# Altium project MezzRev4.PrjPcb (part 3 of 4)

## Sheet DfMUX_ADC.SchDoc: Digital fMUX Mezzanine - ADC
size 513 x 386 mm; Engineer: M.Dobbs, McGill U.; Revision: 4
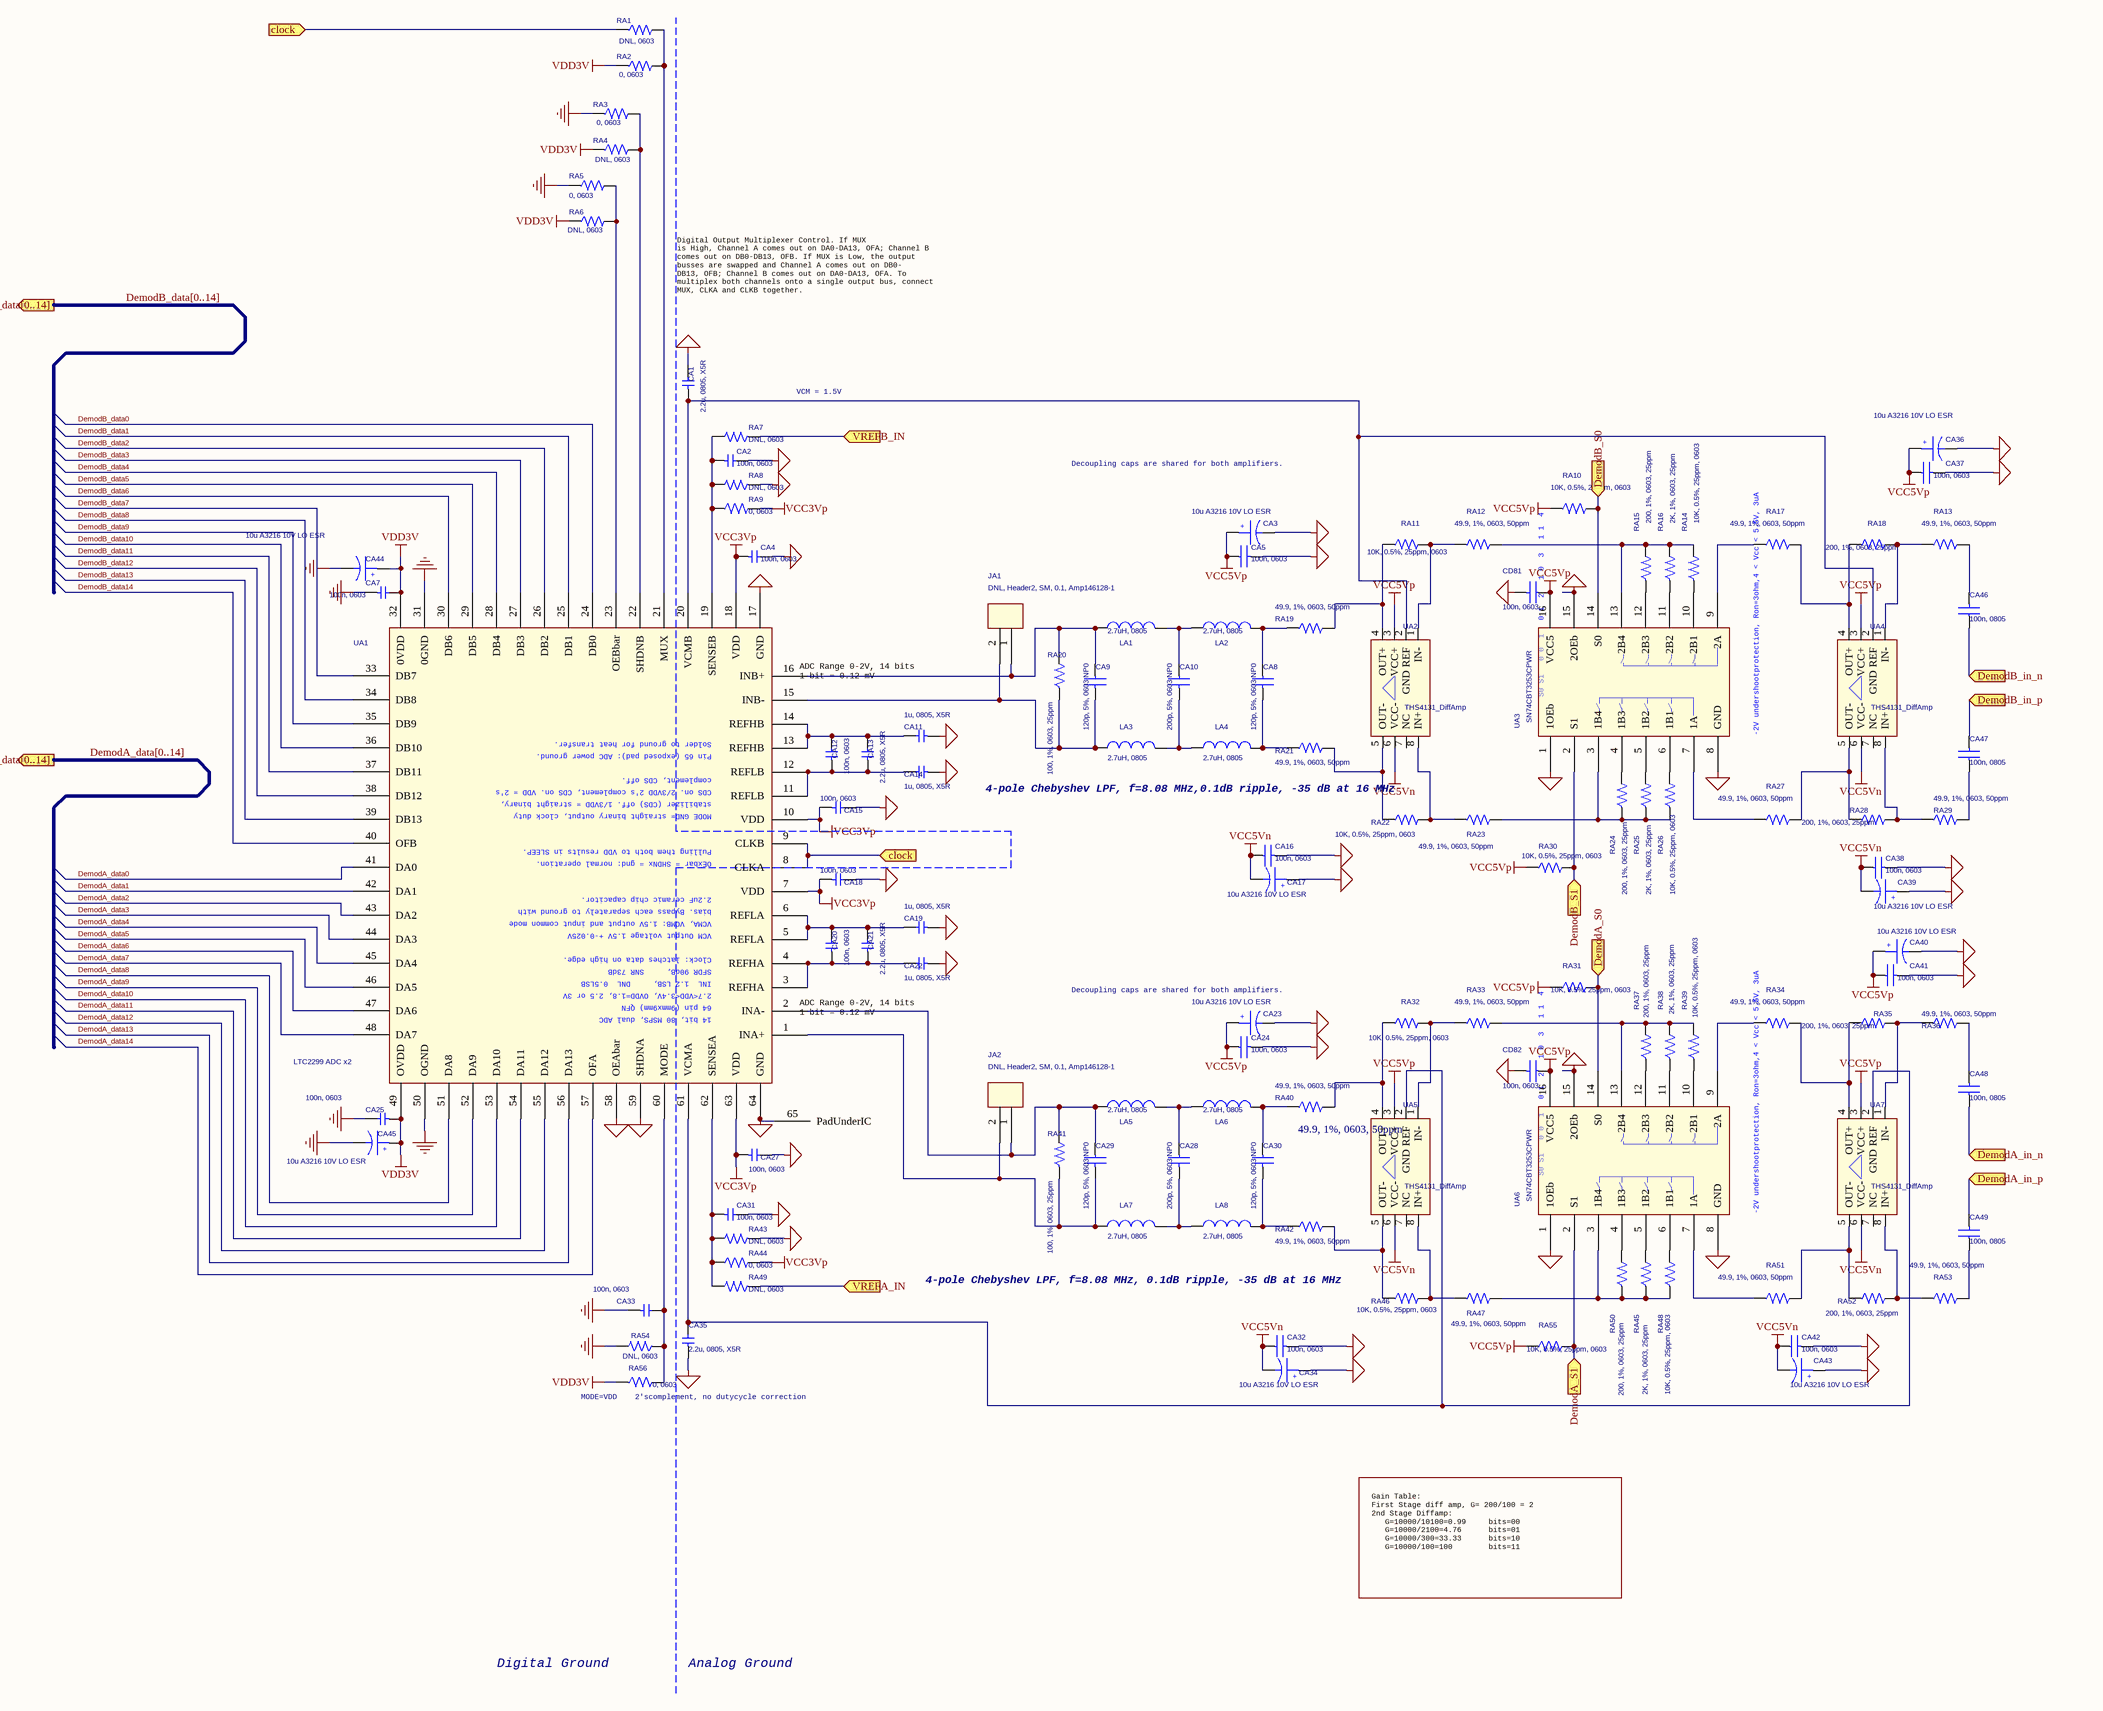
[diagram p6: DfMUX_ADC.SchDoc]

### Parts
CA1  2.2u, 0805, X5R  [0805C]
CA2  100n, 0603  [0603C]
CA3  10u A3216 10V LO ESR  [TANTA]
CA4  100n, 0603  [0603C]
CA5  100n, 0603  [0603C]
CA7  100n, 0603  [0603C]
CA8  120p, 5%, 0603 NP0  [0603C]
CA9  120p, 5%, 0603 NP0  [0603C]
CA10  200p, 5%, 0603 NP0  [0603C]
CA11  1u, 0805, X5R  [0805C]
CA12  100n, 0603  [0603C]
CA13  2.2u, 0805, X5R  [0805C]
CA14  1u, 0805, X5R  [0805C]
CA15  100n, 0603  [0603C]
CA16  100n, 0603  [0603C]
CA17  10u A3216 10V LO ESR  [TANTA]
CA18  100n, 0603  [0603C]
CA19  1u, 0805, X5R  [0805C]
CA20  100n, 0603  [0603C]
CA21  2.2u, 0805, X5R  [0805C]
CA22  1u, 0805, X5R  [0805C]
CA23  10u A3216 10V LO ESR  [TANTA]
CA24  100n, 0603  [0603C]
CA25  100n, 0603  [0603C]
CA27  100n, 0603  [0603C]
CA28  200p, 5%, 0603 NP0  [0603C]
CA29  120p, 5%, 0603 NP0  [0603C]
CA30  120p, 5%, 0603 NP0  [0603C]
CA31  100n, 0603  [0603C]
CA32  100n, 0603  [0603C]
CA33  100n, 0603  [0603C]
CA34  10u A3216 10V LO ESR  [TANTA]
CA35  2.2u, 0805, X5R  [0805C]
CA36  10u A3216 10V LO ESR  [TANTA]
CA37  100n, 0603  [0603C]
CA38  100n, 0603  [0603C]
CA39  10u A3216 10V LO ESR  [TANTA]
CA40  10u A3216 10V LO ESR  [TANTA]
CA41  100n, 0603  [0603C]
CA42  100n, 0603  [0603C]
CA43  10u A3216 10V LO ESR  [TANTA]
CA44  10u A3216 10V LO ESR  [TANTA]
CA45  10u A3216 10V LO ESR  [TANTA]
CA46  100n, 0805  [0805C]
CA47  100n, 0805  [0805C]
CA48  100n, 0805  [0805C]
CA49  100n, 0805  [0805C]
CD81  100n, 0603  [0603C]
CD82  100n, 0603  [0603C]
JA1  DNL, Header2, SM, 0.1, Amp146128-1  [HEADER_AMP146128]
JA2  DNL, Header2, SM, 0.1, Amp146128-1  [HEADER_AMP146128]
LA1  2.7uH, 0805  [0805L]
LA2  2.7uH, 0805  [0805L]
LA3  2.7uH, 0805  [0805L]
LA4  2.7uH, 0805  [0805L]
LA5  2.7uH, 0805  [0805L]
LA6  2.7uH, 0805  [0805L]
LA7  2.7uH, 0805  [0805L]
LA8  2.7uH, 0805  [0805L]
RA1  DNL, 0603  [0603R]
RA2  0, 0603  [0603R]
RA3  0, 0603  [0603R]
RA4  DNL, 0603  [0603R]
RA5  0, 0603  [0603R]
RA6  DNL, 0603  [0603R]
RA7  DNL, 0603  [0603R]
RA8  DNL, 0603  [0603R]
RA9  0, 0603  [0603R]
RA10  10K, 0.5%, 25ppm, 0603  [0603R]
RA11  10K, 0.5%, 25ppm, 0603  [0603R]
RA12  49.9, 1%, 0603, 50ppm  [0603R]
RA13  49.9, 1%, 0603, 50ppm  [0603R]
RA14  10K, 0.5%, 25ppm, 0603  [0603R]
RA15  200, 1%, 0603, 25ppm  [0603R]
RA16  2K, 1%, 0603, 25ppm  [0603R]
RA17  49.9, 1%, 0603, 50ppm  [0603R]
RA18  200, 1%, 0603, 25ppm  [0603R]
RA19  49.9, 1%, 0603, 50ppm  [0603R]
RA20  100, 1%, 0603, 25ppm  [0603R]
RA21  49.9, 1%, 0603, 50ppm  [0603R]
RA22  10K, 0.5%, 25ppm, 0603  [0603R]
RA23  49.9, 1%, 0603, 50ppm  [0603R]
RA24  200, 1%, 0603, 25ppm  [0603R]
RA25  2K, 1%, 0603, 25ppm  [0603R]
RA26  10K, 0.5%, 25ppm, 0603  [0603R]
RA27  49.9, 1%, 0603, 50ppm  [0603R]
RA28  200, 1%, 0603, 25ppm  [0603R]
RA29  49.9, 1%, 0603, 50ppm  [0603R]
RA30  10K, 0.5%, 25ppm, 0603  [0603R]
RA31  10K, 0.5%, 25ppm, 0603  [0603R]
RA32  10K, 0.5%, 25ppm, 0603  [0603R]
RA33  49.9, 1%, 0603, 50ppm  [0603R]
RA34  49.9, 1%, 0603, 50ppm  [0603R]
RA35  200, 1%, 0603, 25ppm  [0603R]
RA36  49.9, 1%, 0603, 50ppm  [0603R]
RA37  200, 1%, 0603, 25ppm  [0603R]
RA38  2K, 1%, 0603, 25ppm  [0603R]
RA39  10K, 0.5%, 25ppm, 0603  [0603R]
RA40  49.9, 1%, 0603, 50ppm  [0603R]
RA41  100, 1%, 0603, 25ppm  [0603R]
RA42  49.9, 1%, 0603, 50ppm  [0603R]
RA43  DNL, 0603  [0603R]
RA44  0, 0603  [0603R]
RA45  2K, 1%, 0603, 25ppm  [0603R]
RA46  10K, 0.5%, 25ppm, 0603  [0603R]
RA47  49.9, 1%, 0603, 50ppm  [0603R]
RA48  10K, 0.5%, 25ppm, 0603  [0603R]
RA49  DNL, 0603  [0603R]
RA50  200, 1%, 0603, 25ppm  [0603R]
RA51  49.9, 1%, 0603, 50ppm  [0603R]
RA52  200, 1%, 0603, 25ppm  [0603R]
RA53  49.9, 1%, 0603, 50ppm  [0603R]
RA54  DNL, 0603  [0603R]
RA55  10K, 0.5%, 25ppm, 0603  [0603R]
RA56  0, 0603  [0603R]
UA1  LTC2299 ADC x2  [QFN64(9X9)]
UA2  THS4131_DiffAmp  [SO8/L200]
UA3  SN74CBT3253CPWR  [TSSOP16]
UA4  THS4131_DiffAmp  [SO8/L200]
UA5  THS4131_DiffAmp  [SO8/L200]
UA6  SN74CBT3253CPWR  [TSSOP16]
UA7  THS4131_DiffAmp  [SO8/L200]

### Ports
clock, DemodA_data[0..14], DemodA_in_n, DemodA_in_p, DemodA_S0, DemodA_S1, DemodB_data[0..14], DemodB_in_n, DemodB_in_p, DemodB_S0, DemodB_S1, VREFA_IN, VREFB_IN

### Nets
GND_DIG: CA7.1 CA25.2 CA33.1 CA44.2 CA45.2 RA3.1 RA5.1 RA54.2 UA1.31(0GND) UA1.50(OGND)
GND_SIGNAL: CA1.2 CA2.2 CA3.2 CA4.2 CA5.2 CA11.1 CA14.1 CA15.2 CA16.2 CA17.1 CA18.2 CA19.1 CA22.1 CA23.2 CA24.2 CA27.2 CA31.2 CA32.2 CA34.1 CA35.1 CA36.2 CA37.2 CA38.2 CA39.1 CA40.2 CA41.2 CA42.2 CA43.1 CD81.2 CD82.2 RA8.1 RA43.1 UA1.17(GND) UA1.58(OEAbar) UA1.59(SHDNA) UA1.64(GND) UA1.65(PadUnderIC) UA3.1(1OEb) UA3.8(GND) UA3.15(2OEb) UA6.1(1OEb) UA6.8(GND) UA6.15(2OEb)
VCC3Vp: CA4.1 CA15.1 CA18.1 CA27.1 RA9.2 RA44.2 UA1.7(VDD) UA1.10(VDD) UA1.18(VDD) UA1.63(VDD)
VCC5Vn: CA16.1 CA17.2 CA32.1 CA34.2 CA38.1 CA39.2 CA42.1 CA43.2 UA2.6(VCC-) UA4.6(VCC-) UA5.6(VCC-) UA7.6(VCC-)
VCC5Vp: CA3.1 CA5.1 CA23.1 CA24.1 CA36.1 CA37.1 CA40.1 CA41.1 CD81.1 CD82.1 RA10.1 RA30.1 RA31.1 RA55.1 UA2.3(VCC+) UA3.16(VCC5) UA4.3(VCC+) UA5.3(VCC+) UA6.16(VCC5) UA7.3(VCC+)
VDD3V: CA7.2 CA25.1 CA44.1 CA45.1 RA2.1 RA4.1 RA6.1 RA56.1 UA1.32(0VDD) UA1.49(OVDD)
DemodA_data0: UA1.41(DA0)  [project net B_DATA0]
DemodA_data1: UA1.42(DA1)  [project net B_DATA1]
DemodA_data2: UA1.43(DA2)  [project net B_DATA2]
DemodA_data3: UA1.44(DA3)  [project net B_DATA3]
DemodA_data4: UA1.45(DA4)  [project net B_DATA4]
DemodA_data5: UA1.46(DA5)  [project net B_DATA5]
DemodA_data6: UA1.47(DA6)  [project net B_DATA6]
DemodA_data7: UA1.48(DA7)  [project net B_DATA7]
DemodA_data8: UA1.51(DA8)  [project net B_DATA8]
DemodA_data9: UA1.52(DA9)  [project net B_DATA9]
DemodA_data10: UA1.53(DA10)  [project net B_DATA10]
DemodA_data11: UA1.54(DA11)  [project net B_DATA11]
DemodA_data12: UA1.55(DA12)  [project net B_DATA12]
DemodA_data13: UA1.56(DA13)  [project net B_DATA13]
DemodA_data14: UA1.57(OFA)  [project net B_DATA14]
DemodB_data0: UA1.24(DB0)  [project net B_DATA0]
DemodB_data1: UA1.25(DB1)  [project net B_DATA1]
DemodB_data2: UA1.26(DB2)  [project net B_DATA2]
DemodB_data3: UA1.27(DB3)  [project net B_DATA3]
DemodB_data4: UA1.28(DB4)  [project net B_DATA4]
DemodB_data5: UA1.29(DB5)  [project net B_DATA5]
DemodB_data6: UA1.30(DB6)  [project net B_DATA6]
DemodB_data7: UA1.33(DB7)  [project net B_DATA7]
DemodB_data8: UA1.34(DB8)  [project net B_DATA8]
DemodB_data9: UA1.35(DB9)  [project net B_DATA9]
DemodB_data10: UA1.36(DB10)  [project net B_DATA10]
DemodB_data11: UA1.37(DB11)  [project net B_DATA11]
DemodB_data12: UA1.38(DB12)  [project net B_DATA12]
DemodB_data13: UA1.39(DB13)  [project net B_DATA13]
DemodB_data14: UA1.40(OFB)  [project net B_DATA14]
Net=Rd37_PartReference_dac_block1_2: RA7.1 ; port VREFB_IN
Net=Rd37_PartReference_dac_block4_2: RA49.1 ; port VREFA_IN
NetCA1_1: CA1.1 UA1.20(VCMB) UA2.2(GND_REF) UA4.2(GND_REF)
NetCA2_1: CA2.1 RA7.2 RA8.2 RA9.1 UA1.19(SENSEB)
NetCA8_1: CA8.1 LA2.2 RA19.1
NetCA8_2: CA8.2 LA4.2 RA21.1
NetCA9_1: CA9.1 JA1.1 LA1.1 RA20.2 UA1.16(INB+)
NetCA9_2: CA9.2 JA1.2 LA3.1 RA20.1 UA1.15(INB-)
NetCA10_1: CA10.1 LA1.2 LA2.1
NetCA10_2: CA10.2 LA3.2 LA4.1
NetCA11_2: CA11.2 CA12.2 CA13.2 UA1.13(REFHB) UA1.14(REFHB)
NetCA12_1: CA12.1 CA13.1 CA14.2 UA1.11(REFLB) UA1.12(REFLB)
NetCA19_2: CA19.2 CA20.2 CA21.2 UA1.5(REFLA) UA1.6(REFLA)
NetCA20_1: CA20.1 CA21.1 CA22.2 UA1.3(REFHA) UA1.4(REFHA)
NetCA28_1: CA28.1 LA5.2 LA6.1
NetCA28_2: CA28.2 LA7.2 LA8.1
NetCA29_1: CA29.1 JA2.1 LA5.1 RA41.2 UA1.2(INA-)
NetCA29_2: CA29.2 JA2.2 LA7.1 RA41.1 UA1.1(INA+)
NetCA30_1: CA30.1 LA6.2 RA40.1
NetCA30_2: CA30.2 LA8.2 RA42.1
NetCA31_1: CA31.1 RA43.2 RA44.1 RA49.2 UA1.62(SENSEA)
NetCA33_2: CA33.2 RA54.1 RA56.2 UA1.60(MODE)
NetCA35_2: CA35.2 UA1.61(VCMA) UA5.2(GND_REF) UA7.2(GND_REF)
NetCA46_1: CA46.1 ; port DemodB_in_n
NetCA46_2: CA46.2 RA13.2
NetCA47_1: CA47.1 RA29.2
NetCA47_2: CA47.2 ; port DemodB_in_p
NetCA48_1: CA48.1 ; port DemodA_in_n
NetCA48_2: CA48.2 RA36.2
NetCA49_1: CA49.1 RA53.2
NetCA49_2: CA49.2 ; port DemodA_in_p
NetRA1_1: RA1.1 UA1.8(CLKA) UA1.9(CLKB) ; port clock
NetRA1_2: RA1.2 RA2.2 UA1.21(MUX)
NetRA3_2: RA3.2 RA4.2 UA1.22(SHDNB)
NetRA5_2: RA5.2 RA6.2 UA1.23(OEBbar)
NetRA10_2: RA10.2 UA3.14(S0) ; port DemodB_S0
NetRA11_1: RA11.1 RA19.2 UA2.4(OUT+)
NetRA11_2: RA11.2 RA12.1 UA2.1(IN-)
NetRA12_2: RA12.2 RA14.2 RA15.2 RA16.2 UA3.13(2B4)
NetRA13_1: RA13.1 RA18.2 UA4.1(IN-)
NetRA14_1: RA14.1 UA3.10(2B1)
NetRA15_1: RA15.1 UA3.12(2B3)
NetRA16_1: RA16.1 UA3.11(2B2)
NetRA17_1: RA17.1 UA3.9(2A)
NetRA17_2: RA17.2 RA18.1 UA4.4(OUT+)
NetRA21_2: RA21.2 RA22.1 UA2.5(OUT-)
NetRA22_2: RA22.2 RA23.1 UA2.8(IN+)
NetRA23_2: RA23.2 RA24.1 RA25.1 RA26.1 UA3.3(1B4)
NetRA24_2: RA24.2 UA3.4(1B3)
NetRA25_2: RA25.2 UA3.5(1B2)
NetRA26_2: RA26.2 UA3.6(1B1)
NetRA27_1: RA27.1 UA3.7(1A)
NetRA27_2: RA27.2 RA28.1 UA4.5(OUT-)
NetRA28_2: RA28.2 RA29.1 UA4.8(IN+)
NetRA30_2: RA30.2 UA3.2(S1) ; port DemodB_S1
NetRA31_2: RA31.2 UA6.14(S0) ; port DemodA_S0
NetRA32_1: RA32.1 RA40.2 UA5.4(OUT+)
NetRA32_2: RA32.2 RA33.1 UA5.1(IN-)
NetRA33_2: RA33.2 RA37.2 RA38.2 RA39.2 UA6.13(2B4)
NetRA34_1: RA34.1 UA6.9(2A)
NetRA34_2: RA34.2 RA35.1 UA7.4(OUT+)
NetRA35_2: RA35.2 RA36.1 UA7.1(IN-)
NetRA37_1: RA37.1 UA6.12(2B3)
NetRA38_1: RA38.1 UA6.11(2B2)
NetRA39_1: RA39.1 UA6.10(2B1)
NetRA42_2: RA42.2 RA46.1 UA5.5(OUT-)
NetRA45_1: RA45.1 RA47.2 RA48.1 RA50.1 UA6.3(1B4)
NetRA45_2: RA45.2 UA6.5(1B2)
NetRA46_2: RA46.2 RA47.1 UA5.8(IN+)
NetRA48_2: RA48.2 UA6.6(1B1)
NetRA50_2: RA50.2 UA6.4(1B3)
NetRA51_1: RA51.1 UA6.7(1A)
NetRA51_2: RA51.2 RA52.1 UA7.5(OUT-)
NetRA52_2: RA52.2 RA53.1 UA7.8(IN+)
NetRA55_2: RA55.2 UA6.2(S1) ; port DemodA_S1

Not connected (* = marked no-connect by the designer): UA2 7(NC); UA4 7(NC); UA5 7(NC); UA7 7(NC)

### Buses and harness runs
bus DemodA_data[0..14] = port DemodA_data[0..14]
bus DemodB_data[0..14] = port DemodB_data[0..14]

### Notes on the sheet
- (near CA1) Digital Output Multiplexer Control. If MUX
  is High, Channel A comes out on DA0-DA13, OFA; Channel B
  comes out on DB0-DB13, OFB. If MUX is Low, the output
  busses are swapped and Channel A comes out on DB0-
  DB13, OFB; Channel B comes out on DA0-DA13, OFA. To
  multiplex both channels onto a single output bus, connect
  MUX, CLKA and CLKB together.
- VCM = 1.5V
- Decoupling caps are shared for both amplifiers.
- (near UA1) ADC Range 0-2V, 14 bits
  1 bit = 0.12 mV
- 4-pole Chebyshev LPF, f=8.08 MHz,0.1dB ripple, -35 dB at 16 MHz
- (near CA23) Decoupling caps are shared for both amplifiers.
- 4-pole Chebyshev LPF, f=8.08 MHz, 0.1dB ripple, -35 dB at 16 MHz
- (near RA56) MODE=VDD    2'scomplement, no dutycycle correction
- Gain Table:
  First Stage diff amp, G= 200/100 = 2
  2nd Stage Diffamp:
  G=10000/10100=0.99     bits=00
  G=10000/2100=4.76      bits=01
  G=10000/300=33.33      bits=10
  G=10000/100=100        bits=11
- Digital Ground
- Analog Ground
- (in symbol CAPACITOR POL) +
- (in symbol LTC2299 ADC x2_3) Solder to ground for heat transfer.; Pin 65 (exposed pad): ADC power ground.; complement, CDS off.; CDS on. 2/3VDD 2's complement, CDS on. VDD = 2's; stabilizer (CDS) off. 1/3VDD = straight binary,; MODE GND= straight binary output, clock duty; Pulling them both to VDD results in SLEEP.; OExbar = SHDNx = gnd: normal operation.; 2.2uF ceramic chip capacitor.; bias. Bypass each separately to ground with; VCMA, VCMB: 1.5V output and input common mode; VCM Output voltage 1.5V +-0.025V; Clock: latches data on high edge.; SFDR 90dB,     SNR 73dB; INL  1.2 LSB,     DNL  0.5LSB; 2.7<VDD<3.4V, OVDD=1.8, 2.5 or 3V; 64 pin (9mmx9mm) QFN; 14 bit, 80 MSPS, dual ADC
- (in symbol SN74CBT3253C 4MUX) S0 S1 / 0 0  1 / 0 1  2 / 1 0  3 / 1 1  4; -2V undershoot / protection, Ron=3ohm, / 4 < Vcc < 5.5V, 3uA

### Library data of the parts
CA1 = C: PSpiceTemplate: C^@REFDES %1 %2 ?TOLERANCE|C^@REFDES| @VALUE ?IC/IC=@IC/ ?TOLERANCE|\n.model C^@REFDES CAP C=1 DEV=@TOLERANCE%|; COMPGROUP: 1; COMPFIXED: NO; COMPHEIGHT: 0.000; COMPLOC: [2632.633,2251.433]; COMPROT: 180; COMPSIDE: TOP; Value: 2.2u, 0805, X5R; COMPKEY: NO; COMPLOCKED: NO; DECOUPLER: NO; MEMORY: NO
CA2 = C: PSpiceTemplate: C^@REFDES %1 %2 ?TOLERANCE|C^@REFDES| @VALUE ?IC/IC=@IC/ ?TOLERANCE|\n.model C^@REFDES CAP C=1 DEV=@TOLERANCE%|; COMPGROUP: 1; COMPFIXED: NO; COMPHEIGHT: 0.000; COMPLOC: [2197.633,2146.433]; COMPROT: 270; COMPSIDE: TOP; Value: 100n, 0603; COMPKEY: NO; COMPLOCKED: NO; DECOUPLER: NO; MEMORY: NO
CA3 = CAPACITOR POL: COMPGROUP: 1; COMPFIXED: NO; COMPHEIGHT: 0.000; COMPLOC: [2892.633,2246.433]; COMPROT: 0; COMPSIDE: TOP; COMPKEY: NO; COMPLOCKED: NO; DECOUPLER: NO; MEMORY: NO
CA4 = C: PSpiceTemplate: C^@REFDES %1 %2 ?TOLERANCE|C^@REFDES| @VALUE ?IC/IC=@IC/ ?TOLERANCE|\n.model C^@REFDES CAP C=1 DEV=@TOLERANCE%|; COMPGROUP: 1; COMPFIXED: NO; COMPHEIGHT: 0.000; COMPLOC: [2117.633,2006.433]; COMPROT: 0; COMPSIDE: BOT; Value: 100n, 0603; COMPKEY: NO; COMPLOCKED: NO; DECOUPLER: NO; MEMORY: NO
CA5 = CAPACITOR NON-POL: COMPGROUP: 1; COMPFIXED: NO; COMPHEIGHT: 0.000; COMPLOC: [2784.633,2230.000]; COMPROT: 180; COMPSIDE: TOP; COMPKEY: NO; COMPLOCKED: NO; DECOUPLER: NO; MEMORY: NO
CA7 = C: PSpiceTemplate: C^@REFDES %1 %2 ?TOLERANCE|C^@REFDES| @VALUE ?IC/IC=@IC/ ?TOLERANCE|\n.model C^@REFDES CAP C=1 DEV=@TOLERANCE%|; COMPGROUP: 1; COMPFIXED: NO; COMPHEIGHT: 0.000; COMPLOC: [1800.633,2003.433]; COMPROT: 270; COMPSIDE: BOT; Value: 100n, 0603; COMPKEY: NO; COMPLOCKED: NO; DECOUPLER: NO; MEMORY: NO
CA8 = CAPACITOR NON-POL: COMPGROUP: 1; COMPFIXED: NO; COMPHEIGHT: 0.000; COMPLOC: [2737.633,1986.433]; COMPROT: 270; COMPSIDE: TOP; COMPKEY: NO; COMPLOCKED: NO; DECOUPLER: NO; MEMORY: NO
CA9 = CAPACITOR NON-POL: COMPGROUP: 1; COMPFIXED: NO; COMPHEIGHT: 0.000; COMPLOC: [2542.633,2136.433]; COMPROT: 270; COMPSIDE: TOP; COMPKEY: NO; COMPLOCKED: NO; DECOUPLER: NO; MEMORY: NO
CA10 = CAPACITOR NON-POL: COMPGROUP: 1; COMPFIXED: NO; COMPHEIGHT: 0.000; COMPLOC: [2607.633,2006.433]; COMPROT: 270; COMPSIDE: TOP; COMPKEY: NO; COMPLOCKED: NO; DECOUPLER: NO; MEMORY: NO
CA11 = C: PSpiceTemplate: C^@REFDES %1 %2 ?TOLERANCE|C^@REFDES| @VALUE ?IC/IC=@IC/ ?TOLERANCE|\n.model C^@REFDES CAP C=1 DEV=@TOLERANCE%|; COMPGROUP: 1; COMPFIXED: NO; COMPHEIGHT: 0.000; COMPLOC: [2417.633,2011.433]; COMPROT: 180; COMPSIDE: TOP; Value: 1u, 0805, X5R; COMPKEY: NO; COMPLOCKED: NO; DECOUPLER: NO; MEMORY: NO
CA12 = C: PSpiceTemplate: C^@REFDES %1 %2 ?TOLERANCE|C^@REFDES| @VALUE ?IC/IC=@IC/ ?TOLERANCE|\n.model C^@REFDES CAP C=1 DEV=@TOLERANCE%|; COMPGROUP: 1; COMPFIXED: NO; COMPHEIGHT: 0.000; COMPLOC: [2202.633,1946.433]; COMPROT: 90; COMPSIDE: TOP; Value: 100n, 0603; COMPKEY: NO; COMPLOCKED: NO; DECOUPLER: NO; MEMORY: NO
CA13 = C: PSpiceTemplate: C^@REFDES %1 %2 ?TOLERANCE|C^@REFDES| @VALUE ?IC/IC=@IC/ ?TOLERANCE|\n.model C^@REFDES CAP C=1 DEV=@TOLERANCE%|; COMPGROUP: 1; COMPFIXED: NO; COMPHEIGHT: 0.000; COMPLOC: [2269.633,1929.433]; COMPROT: 90; COMPSIDE: TOP; Value: 2.2u, 0805, X5R; COMPKEY: NO; COMPLOCKED: NO; DECOUPLER: NO; MEMORY: NO
CA14 = C: PSpiceTemplate: C^@REFDES %1 %2 ?TOLERANCE|C^@REFDES| @VALUE ?IC/IC=@IC/ ?TOLERANCE|\n.model C^@REFDES CAP C=1 DEV=@TOLERANCE%|; COMPGROUP: 1; COMPFIXED: NO; COMPHEIGHT: 0.000; COMPLOC: [2417.633,1931.433]; COMPROT: 180; COMPSIDE: TOP; Value: 1u, 0805, X5R; COMPKEY: NO; COMPLOCKED: NO; DECOUPLER: NO; MEMORY: NO
CA15 = C: PSpiceTemplate: C^@REFDES %1 %2 ?TOLERANCE|C^@REFDES| @VALUE ?IC/IC=@IC/ ?TOLERANCE|\n.model C^@REFDES CAP C=1 DEV=@TOLERANCE%|; COMPGROUP: 1; COMPFIXED: NO; COMPHEIGHT: 0.000; COMPLOC: [2072.633,1951.433]; COMPROT: 0; COMPSIDE: BOT; Value: 100n, 0603; COMPKEY: NO; COMPLOCKED: NO; DECOUPLER: NO; MEMORY: NO
CA16 = CAPACITOR NON-POL: COMPGROUP: 1; COMPFIXED: NO; COMPHEIGHT: 0.000; COMPLOC: [2877.633,2006.433]; COMPROT: 180; COMPSIDE: BOT; COMPKEY: NO; COMPLOCKED: NO; DECOUPLER: NO; MEMORY: NO
CA17 = CAPACITOR POL: COMPGROUP: 1; COMPFIXED: NO; COMPHEIGHT: 0.000; COMPLOC: [2712.633,2081.433]; COMPROT: 180; COMPSIDE: BOT; COMPKEY: NO; COMPLOCKED: NO; DECOUPLER: NO; MEMORY: NO
CA18 = C: PSpiceTemplate: C^@REFDES %1 %2 ?TOLERANCE|C^@REFDES| @VALUE ?IC/IC=@IC/ ?TOLERANCE|\n.model C^@REFDES CAP C=1 DEV=@TOLERANCE%|; COMPGROUP: 1; COMPFIXED: NO; COMPHEIGHT: 0.000; COMPLOC: [2072.633,1866.433]; COMPROT: 0; COMPSIDE: BOT; Value: 100n, 0603; COMPKEY: NO; COMPLOCKED: NO; DECOUPLER: NO; MEMORY: NO
CA19 = C: PSpiceTemplate: C^@REFDES %1 %2 ?TOLERANCE|C^@REFDES| @VALUE ?IC/IC=@IC/ ?TOLERANCE|\n.model C^@REFDES CAP C=1 DEV=@TOLERANCE%|; COMPGROUP: 1; COMPFIXED: NO; COMPHEIGHT: 0.000; COMPLOC: [2414.633,1853.433]; COMPROT: 180; COMPSIDE: TOP; Value: 1u, 0805, X5R; COMPKEY: NO; COMPLOCKED: NO; DECOUPLER: NO; MEMORY: NO
CA20 = C: PSpiceTemplate: C^@REFDES %1 %2 ?TOLERANCE|C^@REFDES| @VALUE ?IC/IC=@IC/ ?TOLERANCE|\n.model C^@REFDES CAP C=1 DEV=@TOLERANCE%|; COMPGROUP: 1; COMPFIXED: NO; COMPHEIGHT: 0.000; COMPLOC: [2202.633,1796.433]; COMPROT: 90; COMPSIDE: TOP; Value: 100n, 0603; COMPKEY: NO; COMPLOCKED: NO; DECOUPLER: NO; MEMORY: NO
CA21 = C: PSpiceTemplate: C^@REFDES %1 %2 ?TOLERANCE|C^@REFDES| @VALUE ?IC/IC=@IC/ ?TOLERANCE|\n.model C^@REFDES CAP C=1 DEV=@TOLERANCE%|; COMPGROUP: 1; COMPFIXED: NO; COMPHEIGHT: 0.000; COMPLOC: [2267.633,1771.433]; COMPROT: 90; COMPSIDE: TOP; Value: 2.2u, 0805, X5R; COMPKEY: NO; COMPLOCKED: NO; DECOUPLER: NO; MEMORY: NO
CA22 = C: PSpiceTemplate: C^@REFDES %1 %2 ?TOLERANCE|C^@REFDES| @VALUE ?IC/IC=@IC/ ?TOLERANCE|\n.model C^@REFDES CAP C=1 DEV=@TOLERANCE%|; COMPGROUP: 1; COMPFIXED: NO; COMPHEIGHT: 0.000; COMPLOC: [2416.633,1771.433]; COMPROT: 180; COMPSIDE: TOP; Value: 1u, 0805, X5R; COMPKEY: NO; COMPLOCKED: NO; DECOUPLER: NO; MEMORY: NO
CA23 = CAPACITOR POL: COMPGROUP: 1; COMPFIXED: NO; COMPHEIGHT: 0.000; COMPLOC: [2892.633,1751.433]; COMPROT: 0; COMPSIDE: TOP; COMPKEY: NO; COMPLOCKED: NO; DECOUPLER: NO; MEMORY: NO
CA24 = CAPACITOR NON-POL: COMPGROUP: 1; COMPFIXED: NO; COMPHEIGHT: 0.000; COMPLOC: [2792.633,1731.433]; COMPROT: 180; COMPSIDE: TOP; COMPKEY: NO; COMPLOCKED: NO; DECOUPLER: NO; MEMORY: NO
CA25 = C: PSpiceTemplate: C^@REFDES %1 %2 ?TOLERANCE|C^@REFDES| @VALUE ?IC/IC=@IC/ ?TOLERANCE|\n.model C^@REFDES CAP C=1 DEV=@TOLERANCE%|; COMPGROUP: 1; COMPFIXED: NO; COMPHEIGHT: 0.000; COMPLOC: [1802.633,1761.433]; COMPROT: 270; COMPSIDE: BOT; Value: 100n, 0603; COMPKEY: NO; COMPLOCKED: NO; DECOUPLER: NO; MEMORY: NO
CA27 = C: PSpiceTemplate: C^@REFDES %1 %2 ?TOLERANCE|C^@REFDES| @VALUE ?IC/IC=@IC/ ?TOLERANCE|\n.model C^@REFDES CAP C=1 DEV=@TOLERANCE%|; COMPGROUP: 1; COMPFIXED: NO; COMPHEIGHT: 0.000; COMPLOC: [2168.633,1683.367]; COMPROT: 0; COMPSIDE: TOP; Value: 100n, 0603; COMPKEY: NO; COMPLOCKED: NO; DECOUPLER: NO; MEMORY: NO
CA28 = CAPACITOR NON-POL: COMPGROUP: 1; COMPFIXED: NO; COMPHEIGHT: 0.000; COMPLOC: [2607.633,1521.433]; COMPROT: 270; COMPSIDE: TOP; FPLIST: 0805L; COMPKEY: NO; COMPLOCKED: NO; DECOUPLER: NO; MEMORY: NO
CA29 = CAPACITOR NON-POL: COMPGROUP: 1; COMPFIXED: NO; COMPHEIGHT: 0.000; COMPLOC: [2592.633,1641.433]; COMPROT: 270; COMPSIDE: TOP; COMPKEY: NO; COMPLOCKED: NO; DECOUPLER: NO; MEMORY: NO
CA30 = CAPACITOR NON-POL: COMPGROUP: 1; COMPFIXED: NO; COMPHEIGHT: 0.000; COMPLOC: [2737.633,1491.433]; COMPROT: 270; COMPSIDE: TOP; COMPKEY: NO; COMPLOCKED: NO; DECOUPLER: NO; MEMORY: NO
CA31 = C: PSpiceTemplate: C^@REFDES %1 %2 ?TOLERANCE|C^@REFDES| @VALUE ?IC/IC=@IC/ ?TOLERANCE|\n.model C^@REFDES CAP C=1 DEV=@TOLERANCE%|; COMPGROUP: 1; COMPFIXED: NO; COMPHEIGHT: 0.000; COMPLOC: [2070.000,1815.000]; COMPROT: 0; COMPSIDE: BOT; Value: 100n, 0603; COMPKEY: NO; COMPLOCKED: NO; DECOUPLER: NO; MEMORY: NO
CA32 = CAPACITOR NON-POL: COMPGROUP: 1; COMPFIXED: NO; COMPHEIGHT: 0.000; COMPLOC: [2877.633,1511.433]; COMPROT: 180; COMPSIDE: BOT; COMPKEY: NO; COMPLOCKED: NO; DECOUPLER: NO; MEMORY: NO
CA33 = C: PSpiceTemplate: C^@REFDES %1 %2 ?TOLERANCE|C^@REFDES| @VALUE ?IC/IC=@IC/ ?TOLERANCE|\n.model C^@REFDES CAP C=1 DEV=@TOLERANCE%|; COMPGROUP: 1; COMPFIXED: NO; COMPHEIGHT: 0.000; COMPLOC: [2012.633,1624.367]; COMPROT: 90; COMPSIDE: TOP; Value: 100n, 0603; COMPKEY: NO; COMPLOCKED: NO; DECOUPLER: NO; MEMORY: NO
CA34 = CAPACITOR POL: COMPGROUP: 1; COMPFIXED: NO; COMPHEIGHT: 0.000; COMPLOC: [2712.633,1586.433]; COMPROT: 180; COMPSIDE: BOT; COMPKEY: NO; COMPLOCKED: NO; DECOUPLER: NO; MEMORY: NO
CA35 = C: PSpiceTemplate: C^@REFDES %1 %2 ?TOLERANCE|C^@REFDES| @VALUE ?IC/IC=@IC/ ?TOLERANCE|\n.model C^@REFDES CAP C=1 DEV=@TOLERANCE%|; COMPGROUP: 1; COMPFIXED: NO; COMPHEIGHT: 0.000; COMPLOC: [2547.633,1756.433]; COMPROT: 0; COMPSIDE: TOP; Value: 2.2u, 0805, X5R; COMPKEY: NO; COMPLOCKED: NO; DECOUPLER: NO; MEMORY: NO
CA36 = CAPACITOR POL: COMPGROUP: 1; COMPFIXED: NO; COMPHEIGHT: 0.000; COMPLOC: [3567.633,2246.433]; COMPROT: 180; COMPSIDE: TOP; COMPKEY: NO; COMPLOCKED: NO; DECOUPLER: NO; MEMORY: NO
CA37 = CAPACITOR NON-POL: COMPGROUP: 1; COMPFIXED: NO; COMPHEIGHT: 0.000; COMPLOC: [3622.633,2246.433]; COMPROT: 0; COMPSIDE: TOP; COMPKEY: NO; COMPLOCKED: NO; DECOUPLER: NO; MEMORY: NO
CA38 = CAPACITOR NON-POL: COMPGROUP: 1; COMPFIXED: NO; COMPHEIGHT: 0.000; COMPLOC: [3606.633,2036.433]; COMPROT: 180; COMPSIDE: BOT; COMPKEY: NO; COMPLOCKED: NO; DECOUPLER: NO; MEMORY: NO
CA39 = CAPACITOR POL: COMPGROUP: 1; COMPFIXED: NO; COMPHEIGHT: 0.000; COMPLOC: [3697.633,1966.433]; COMPROT: 0; COMPSIDE: BOT; COMPKEY: NO; COMPLOCKED: NO; DECOUPLER: NO; MEMORY: NO
CA40 = CAPACITOR POL: COMPGROUP: 1; COMPFIXED: NO; COMPHEIGHT: 0.000; COMPLOC: [3567.633,1751.433]; COMPROT: 180; COMPSIDE: TOP; COMPKEY: NO; COMPLOCKED: NO; DECOUPLER: NO; MEMORY: NO
CA41 = CAPACITOR NON-POL: COMPGROUP: 1; COMPFIXED: NO; COMPHEIGHT: 0.000; COMPLOC: [3622.633,1751.433]; COMPROT: 0; COMPSIDE: TOP; COMPKEY: NO; COMPLOCKED: NO; DECOUPLER: NO; MEMORY: NO
CA42 = CAPACITOR NON-POL: COMPGROUP: 1; COMPFIXED: NO; COMPHEIGHT: 0.000; COMPLOC: [3606.633,1531.433]; COMPROT: 180; COMPSIDE: BOT; COMPKEY: NO; COMPLOCKED: NO; DECOUPLER: NO; MEMORY: NO
CA43 = CAPACITOR POL: COMPGROUP: 1; COMPFIXED: NO; COMPHEIGHT: 0.000; COMPLOC: [3697.633,1461.433]; COMPROT: 0; COMPSIDE: BOT; COMPKEY: NO; COMPLOCKED: NO; DECOUPLER: NO; MEMORY: NO
CA44 = CAPACITOR POL: COMPGROUP: 1; COMPFIXED: NO; COMPHEIGHT: 0.000; COMPLOC: [1732.633,2131.433]; COMPROT: 90; COMPSIDE: BOT; COMPKEY: NO; COMPLOCKED: NO; DECOUPLER: NO; MEMORY: NO
CA45 = CAPACITOR POL: COMPGROUP: 1; COMPFIXED: NO; COMPHEIGHT: 0.000; COMPLOC: [1732.633,1686.433]; COMPROT: 270; COMPSIDE: BOT; COMPKEY: NO; COMPLOCKED: NO; DECOUPLER: NO; MEMORY: NO
CA46 = CAPACITOR NON-POL: COMPGROUP: 1; COMPFIXED: NO; COMPHEIGHT: 0.000; COMPLOC: [3869.633,2180.000]; COMPROT: 180; COMPSIDE: TOP; COMPKEY: NO; COMPLOCKED: NO; DECOUPLER: NO; MEMORY: NO
CA47 = CAPACITOR NON-POL: COMPGROUP: 1; COMPFIXED: NO; COMPHEIGHT: 0.000; COMPLOC: [3784.633,2105.000]; COMPROT: 0; COMPSIDE: TOP; COMPKEY: NO; COMPLOCKED: NO; DECOUPLER: NO; MEMORY: NO
CA48 = CAPACITOR NON-POL: COMPGROUP: 1; COMPFIXED: NO; COMPHEIGHT: 0.000; COMPLOC: [3874.633,1680.000]; COMPROT: 180; COMPSIDE: TOP; COMPKEY: NO; COMPLOCKED: NO; DECOUPLER: NO; MEMORY: NO
CA49 = CAPACITOR NON-POL: COMPGROUP: 1; COMPFIXED: NO; COMPHEIGHT: 0.000; COMPLOC: [3789.633,1605.000]; COMPROT: 0; COMPSIDE: TOP; COMPKEY: NO; COMPLOCKED: NO; DECOUPLER: NO; MEMORY: NO
CD81 = CAPACITOR NON-POL: COMPGROUP: 1; COMPFIXED: NO; COMPHEIGHT: 0.000; COMPLOC: [3172.633,2246.433]; COMPROT: 180; COMPSIDE: TOP; COMPKEY: NO; COMPLOCKED: NO; DECOUPLER: NO; MEMORY: NO
CD82 = CAPACITOR NON-POL: COMPGROUP: 1; COMPFIXED: NO; COMPHEIGHT: 0.000; COMPLOC: [3172.633,1746.433]; COMPROT: 180; COMPSIDE: TOP; COMPKEY: NO; COMPLOCKED: NO; DECOUPLER: NO; MEMORY: NO
JA1 = CONN_TRBLK_2: COMPGROUP: 1; COMPFIXED: NO; COMPHEIGHT: 0.000; COMPLOC: [2507.633,2186.433]; COMPROT: 270; COMPSIDE: TOP; COMPKEY: NO; COMPLOCKED: NO; DECOUPLER: NO; MEMORY: NO
JA2 = CONN_TRBLK_2: COMPGROUP: 1; COMPFIXED: NO; COMPHEIGHT: 0.000; COMPLOC: [2507.633,1691.433]; COMPROT: 270; COMPSIDE: TOP; COMPKEY: NO; COMPLOCKED: NO; DECOUPLER: NO; MEMORY: NO
LA1 = INDUCTOR/SM: COMPGROUP: 1; COMPFIXED: NO; COMPHEIGHT: 0.000; COMPLOC: [2662.633,2176.433]; COMPROT: 270; COMPSIDE: TOP; COMPKEY: NO; COMPLOCKED: NO; DECOUPLER: NO; MEMORY: NO
LA2 = INDUCTOR/SM: COMPGROUP: 1; COMPFIXED: NO; COMPHEIGHT: 0.000; COMPLOC: [2672.633,2031.433]; COMPROT: 270; COMPSIDE: TOP; COMPKEY: NO; COMPLOCKED: NO; DECOUPLER: NO; MEMORY: NO
LA3 = INDUCTOR/SM: COMPGROUP: 1; COMPFIXED: NO; COMPHEIGHT: 0.000; COMPLOC: [2542.633,2026.433]; COMPROT: 270; COMPSIDE: TOP; COMPKEY: NO; COMPLOCKED: NO; DECOUPLER: NO; MEMORY: NO
LA4 = INDUCTOR/SM: COMPGROUP: 1; COMPFIXED: NO; COMPHEIGHT: 0.000; COMPLOC: [2562.633,1881.433]; COMPROT: 0; COMPSIDE: TOP; COMPKEY: NO; COMPLOCKED: NO; DECOUPLER: NO; MEMORY: NO
LA5 = INDUCTOR/SM: COMPGROUP: 1; COMPFIXED: NO; COMPHEIGHT: 0.000; COMPLOC: [2662.633,1681.433]; COMPROT: 270; COMPSIDE: TOP; COMPKEY: NO; COMPLOCKED: NO; DECOUPLER: NO; MEMORY: NO
LA6 = INDUCTOR/SM: COMPGROUP: 1; COMPFIXED: NO; COMPHEIGHT: 0.000; COMPLOC: [2672.633,1536.433]; COMPROT: 270; COMPSIDE: TOP; COMPKEY: NO; COMPLOCKED: NO; DECOUPLER: NO; MEMORY: NO
LA7 = INDUCTOR/SM: COMPGROUP: 1; COMPFIXED: NO; COMPHEIGHT: 0.000; COMPLOC: [2539.633,1538.433]; COMPROT: 270; COMPSIDE: TOP; COMPKEY: NO; COMPLOCKED: NO; DECOUPLER: NO; MEMORY: NO
LA8 = INDUCTOR/SM: COMPGROUP: 1; COMPFIXED: NO; COMPHEIGHT: 0.000; COMPLOC: [2572.633,1391.433]; COMPROT: 0; COMPSIDE: TOP; COMPKEY: NO; COMPLOCKED: NO; DECOUPLER: NO; MEMORY: NO
RA1 = R_Dup2: PSpiceTemplate: R^@REFDES %1 %2 ?TOLERANCE|R^@REFDES| @VALUE  ?TOLERANCE|\n.model R^@REFDES RES R=1 DEV=@TOLERANCE%|; COMPGROUP: 1; COMPFIXED: NO; COMPHEIGHT: 0.000; COMPLOC: [1949.633,2050.000]; COMPROT: 180; COMPSIDE: BOT; Value: DNL, 0603; COMPKEY: NO; COMPLOCKED: NO; DECOUPLER: NO; MEMORY: NO
RA2 = R_Dup2: PSpiceTemplate: R^@REFDES %1 %2 ?TOLERANCE|R^@REFDES| @VALUE  ?TOLERANCE|\n.model R^@REFDES RES R=1 DEV=@TOLERANCE%|; COMPGROUP: 1; COMPFIXED: NO; COMPHEIGHT: 0.000; COMPLOC: [2092.633,2151.433]; COMPROT: 180; COMPSIDE: TOP; Value: 0, 0603; COMPKEY: NO; COMPLOCKED: NO; DECOUPLER: NO; MEMORY: NO
RA3 = R_Dup2: PSpiceTemplate: R^@REFDES %1 %2 ?TOLERANCE|R^@REFDES| @VALUE  ?TOLERANCE|\n.model R^@REFDES RES R=1 DEV=@TOLERANCE%|; COMPGROUP: 1; COMPFIXED: NO; COMPHEIGHT: 0.000; COMPLOC: [2132.633,2206.433]; COMPROT: 180; COMPSIDE: TOP; Value: 0, 0603; COMPKEY: NO; COMPLOCKED: NO; DECOUPLER: NO; MEMORY: NO
RA4 = R_Dup2: PSpiceTemplate: R^@REFDES %1 %2 ?TOLERANCE|R^@REFDES| @VALUE  ?TOLERANCE|\n.model R^@REFDES RES R=1 DEV=@TOLERANCE%|; COMPGROUP: 1; COMPFIXED: NO; COMPHEIGHT: 0.000; COMPLOC: [2108.633,2261.433]; COMPROT: 180; COMPSIDE: TOP; Value: DNL, 0603; COMPKEY: NO; COMPLOCKED: NO; DECOUPLER: NO; MEMORY: NO
RA5 = R_Dup2: PSpiceTemplate: R^@REFDES %1 %2 ?TOLERANCE|R^@REFDES| @VALUE  ?TOLERANCE|\n.model R^@REFDES RES R=1 DEV=@TOLERANCE%|; COMPGROUP: 1; COMPFIXED: NO; COMPHEIGHT: 0.000; COMPLOC: [1972.633,2206.433]; COMPROT: 0; COMPSIDE: TOP; Value: 0, 0603; COMPKEY: NO; COMPLOCKED: NO; DECOUPLER: NO; MEMORY: NO
RA6 = R_Dup2: PSpiceTemplate: R^@REFDES %1 %2 ?TOLERANCE|R^@REFDES| @VALUE  ?TOLERANCE|\n.model R^@REFDES RES R=1 DEV=@TOLERANCE%|; COMPGROUP: 1; COMPFIXED: NO; COMPHEIGHT: 0.000; COMPLOC: [1952.633,2261.433]; COMPROT: 0; COMPSIDE: TOP; Value: DNL, 0603; COMPKEY: NO; COMPLOCKED: NO; DECOUPLER: NO; MEMORY: NO
RA7 = R_Dup2: PSpiceTemplate: R^@REFDES %1 %2 ?TOLERANCE|R^@REFDES| @VALUE  ?TOLERANCE|\n.model R^@REFDES RES R=1 DEV=@TOLERANCE%|; COMPGROUP: 1; COMPFIXED: NO; COMPHEIGHT: 0.000; COMPLOC: [2362.633,2204.367]; COMPROT: 180; COMPSIDE: TOP; Value: DNL, 0603; COMPKEY: NO; COMPLOCKED: NO; DECOUPLER: NO; MEMORY: NO
RA8 = R_Dup2: PSpiceTemplate: R^@REFDES %1 %2 ?TOLERANCE|R^@REFDES| @VALUE  ?TOLERANCE|\n.model R^@REFDES RES R=1 DEV=@TOLERANCE%|; COMPGROUP: 1; COMPFIXED: NO; COMPHEIGHT: 0.000; COMPLOC: [2252.633,2091.433]; COMPROT: 90; COMPSIDE: TOP; Value: DNL, 0603; COMPKEY: NO; COMPLOCKED: NO; DECOUPLER: NO; MEMORY: NO
RA9 = R_Dup2: PSpiceTemplate: R^@REFDES %1 %2 ?TOLERANCE|R^@REFDES| @VALUE  ?TOLERANCE|\n.model R^@REFDES RES R=1 DEV=@TOLERANCE%|; COMPGROUP: 1; COMPFIXED: NO; COMPHEIGHT: 0.000; COMPLOC: [2307.633,2151.433]; COMPROT: 0; COMPSIDE: TOP; Value: 0, 0603; COMPKEY: NO; COMPLOCKED: NO; DECOUPLER: NO; MEMORY: NO
RA10 = R_Dup2: PSpiceTemplate: R^@REFDES %1 %2 ?TOLERANCE|R^@REFDES| @VALUE  ?TOLERANCE|\n.model R^@REFDES RES R=1 DEV=@TOLERANCE%|; COMPGROUP: 1; COMPFIXED: NO; COMPHEIGHT: 0.000; COMPLOC: [3307.633,2246.433]; COMPROT: 180; COMPSIDE: TOP; Value: 10K, 0.5%, 25ppm, 0603; COMPKEY: NO; COMPLOCKED: NO; DECOUPLER: NO; MEMORY: NO
RA11 = R_Dup2: PSpiceTemplate: R^@REFDES %1 %2 ?TOLERANCE|R^@REFDES| @VALUE  ?TOLERANCE|\n.model R^@REFDES RES R=1 DEV=@TOLERANCE%|; COMPGROUP: 1; COMPFIXED: NO; COMPHEIGHT: 0.000; COMPLOC: [3012.633,2036.433]; COMPROT: 90; COMPSIDE: TOP; Value: 10K, 0.5%, 25ppm, 0603; COMPKEY: NO; COMPLOCKED: NO; DECOUPLER: NO; MEMORY: NO
RA12 = R_Dup2: PSpiceTemplate: R^@REFDES %1 %2 ?TOLERANCE|R^@REFDES| @VALUE  ?TOLERANCE|\n.model R^@REFDES RES R=1 DEV=@TOLERANCE%|; COMPGROUP: 1; COMPFIXED: NO; COMPHEIGHT: 0.000; COMPLOC: [3012.633,2135.433]; COMPROT: 90; COMPSIDE: TOP; Value: 49.9, 1%, 0603, 50ppm; COMPKEY: NO; COMPLOCKED: NO; DECOUPLER: NO; MEMORY: NO
RA13 = R_Dup2: PSpiceTemplate: R^@REFDES %1 %2 ?TOLERANCE|R^@REFDES| @VALUE  ?TOLERANCE|\n.model R^@REFDES RES R=1 DEV=@TOLERANCE%|; COMPGROUP: 1; COMPFIXED: NO; COMPHEIGHT: 0.000; COMPLOC: [3719.633,2134.000]; COMPROT: 90; COMPSIDE: TOP; Value: 49.9, 1%, 0603, 50ppm; COMPKEY: NO; COMPLOCKED: NO; DECOUPLER: NO; MEMORY: NO
RA14 = R_Dup2: PSpiceTemplate: R^@REFDES %1 %2 ?TOLERANCE|R^@REFDES| @VALUE  ?TOLERANCE|\n.model R^@REFDES RES R=1 DEV=@TOLERANCE%|; COMPGROUP: 1; COMPFIXED: NO; COMPHEIGHT: 0.000; COMPLOC: [3112.633,2081.433]; COMPROT: 180; COMPSIDE: TOP; Value: 10K, 0.5%, 25ppm, 0603; COMPKEY: NO; COMPLOCKED: NO; DECOUPLER: NO; MEMORY: NO
RA15 = R_Dup2: PSpiceTemplate: R^@REFDES %1 %2 ?TOLERANCE|R^@REFDES| @VALUE  ?TOLERANCE|\n.model R^@REFDES RES R=1 DEV=@TOLERANCE%|; COMPGROUP: 1; COMPFIXED: NO; COMPHEIGHT: 0.000; COMPLOC: [3112.633,2191.433]; COMPROT: 180; COMPSIDE: TOP; Value: 200, 1%, 0603, 25ppm; COMPKEY: NO; COMPLOCKED: NO; DECOUPLER: NO; MEMORY: NO
RA16 = R_Dup2: PSpiceTemplate: R^@REFDES %1 %2 ?TOLERANCE|R^@REFDES| @VALUE  ?TOLERANCE|\n.model R^@REFDES RES R=1 DEV=@TOLERANCE%|; COMPGROUP: 1; COMPFIXED: NO; COMPHEIGHT: 0.000; COMPLOC: [3112.633,2136.433]; COMPROT: 180; COMPSIDE: TOP; Value: 2K, 1%, 0603, 25ppm; COMPKEY: NO; COMPLOCKED: NO; DECOUPLER: NO; MEMORY: NO
RA17 = R_Dup2: PSpiceTemplate: R^@REFDES %1 %2 ?TOLERANCE|R^@REFDES| @VALUE  ?TOLERANCE|\n.model R^@REFDES RES R=1 DEV=@TOLERANCE%|; COMPGROUP: 1; COMPFIXED: NO; COMPHEIGHT: 0.000; COMPLOC: [3402.633,2181.433]; COMPROT: 0; COMPSIDE: TOP; Value: 49.9, 1%, 0603, 50ppm; COMPKEY: NO; COMPLOCKED: NO; DECOUPLER: NO; MEMORY: NO
RA18 = R_Dup2: PSpiceTemplate: R^@REFDES %1 %2 ?TOLERANCE|R^@REFDES| @VALUE  ?TOLERANCE|\n.model R^@REFDES RES R=1 DEV=@TOLERANCE%|; COMPGROUP: 1; COMPFIXED: NO; COMPHEIGHT: 0.000; COMPLOC: [3457.633,2136.433]; COMPROT: 270; COMPSIDE: TOP; Value: 200, 1%, 0603, 25ppm; COMPKEY: NO; COMPLOCKED: NO; DECOUPLER: NO; MEMORY: NO
RA19 = R_Dup2: PSpiceTemplate: R^@REFDES %1 %2 ?TOLERANCE|R^@REFDES| @VALUE  ?TOLERANCE|\n.model R^@REFDES RES R=1 DEV=@TOLERANCE%|; COMPGROUP: 1; COMPFIXED: NO; COMPHEIGHT: 0.000; COMPLOC: [2737.633,2031.433]; COMPROT: 90; COMPSIDE: TOP; Value: 49.9, 1%, 0603, 50ppm; COMPKEY: NO; COMPLOCKED: NO; DECOUPLER: NO; MEMORY: NO
RA20 = R_Dup2: PSpiceTemplate: R^@REFDES %1 %2 ?TOLERANCE|R^@REFDES| @VALUE  ?TOLERANCE|\n.model R^@REFDES RES R=1 DEV=@TOLERANCE%|; COMPGROUP: 1; COMPFIXED: NO; COMPHEIGHT: 0.000; COMPLOC: [2597.633,2081.433]; COMPROT: 90; COMPSIDE: TOP; Value: 100, 1%, 0603, 25ppm; COMPKEY: NO; COMPLOCKED: NO; DECOUPLER: NO; MEMORY: NO
RA21 = R_Dup2: PSpiceTemplate: R^@REFDES %1 %2 ?TOLERANCE|R^@REFDES| @VALUE  ?TOLERANCE|\n.model R^@REFDES RES R=1 DEV=@TOLERANCE%|; COMPGROUP: 1; COMPFIXED: NO; COMPHEIGHT: 0.000; COMPLOC: [2787.633,1876.433]; COMPROT: 0; COMPSIDE: TOP; Value: 49.9, 1%, 0603, 50ppm; COMPKEY: NO; COMPLOCKED: NO; DECOUPLER: NO; MEMORY: NO
RA22 = R_Dup2: PSpiceTemplate: R^@REFDES %1 %2 ?TOLERANCE|R^@REFDES| @VALUE  ?TOLERANCE|\n.model R^@REFDES RES R=1 DEV=@TOLERANCE%|; COMPGROUP: 1; COMPFIXED: NO; COMPHEIGHT: 0.000; COMPLOC: [2887.633,1876.433]; COMPROT: 0; COMPSIDE: TOP; Value: 10K, 0.5%, 25ppm, 0603; COMPKEY: NO; COMPLOCKED: NO; DECOUPLER: NO; MEMORY: NO
RA23 = R_Dup2: PSpiceTemplate: R^@REFDES %1 %2 ?TOLERANCE|R^@REFDES| @VALUE  ?TOLERANCE|\n.model R^@REFDES RES R=1 DEV=@TOLERANCE%|; COMPGROUP: 1; COMPFIXED: NO; COMPHEIGHT: 0.000; COMPLOC: [3012.633,1971.433]; COMPROT: 270; COMPSIDE: TOP; Value: 49.9, 1%, 0603, 50ppm; COMPKEY: NO; COMPLOCKED: NO; DECOUPLER: NO; MEMORY: NO
RA24 = R_Dup2: PSpiceTemplate: R^@REFDES %1 %2 ?TOLERANCE|R^@REFDES| @VALUE  ?TOLERANCE|\n.model R^@REFDES RES R=1 DEV=@TOLERANCE%|; COMPGROUP: 1; COMPFIXED: NO; COMPHEIGHT: 0.000; COMPLOC: [3057.633,1916.433]; COMPROT: 0; COMPSIDE: TOP; Value: 200, 1%, 0603, 25ppm; COMPKEY: NO; COMPLOCKED: NO; DECOUPLER: NO; MEMORY: NO
RA25 = R_Dup2: PSpiceTemplate: R^@REFDES %1 %2 ?TOLERANCE|R^@REFDES| @VALUE  ?TOLERANCE|\n.model R^@REFDES RES R=1 DEV=@TOLERANCE%|; COMPGROUP: 1; COMPFIXED: NO; COMPHEIGHT: 0.000; COMPLOC: [3057.633,1971.433]; COMPROT: 0; COMPSIDE: TOP; Value: 2K, 1%, 0603, 25ppm; COMPKEY: NO; COMPLOCKED: NO; DECOUPLER: NO; MEMORY: NO
RA26 = R_Dup2: PSpiceTemplate: R^@REFDES %1 %2 ?TOLERANCE|R^@REFDES| @VALUE  ?TOLERANCE|\n.model R^@REFDES RES R=1 DEV=@TOLERANCE%|; COMPGROUP: 1; COMPFIXED: NO; COMPHEIGHT: 0.000; COMPLOC: [3057.633,2026.433]; COMPROT: 0; COMPSIDE: TOP; Value: 10K, 0.5%, 25ppm, 0603; COMPKEY: NO; COMPLOCKED: NO; DECOUPLER: NO; MEMORY: NO
RA27 = R_Dup2: PSpiceTemplate: R^@REFDES %1 %2 ?TOLERANCE|R^@REFDES| @VALUE  ?TOLERANCE|\n.model R^@REFDES RES R=1 DEV=@TOLERANCE%|; COMPGROUP: 1; COMPFIXED: NO; COMPHEIGHT: 0.000; COMPLOC: [3402.633,1926.433]; COMPROT: 0; COMPSIDE: TOP; Value: 49.9, 1%, 0603, 50ppm; COMPKEY: NO; COMPLOCKED: NO; DECOUPLER: NO; MEMORY: NO
RA28 = R_Dup2: PSpiceTemplate: R^@REFDES %1 %2 ?TOLERANCE|R^@REFDES| @VALUE  ?TOLERANCE|\n.model R^@REFDES RES R=1 DEV=@TOLERANCE%|; COMPGROUP: 1; COMPFIXED: NO; COMPHEIGHT: 0.000; COMPLOC: [3457.633,1971.433]; COMPROT: 90; COMPSIDE: TOP; Value: 200, 1%, 0603, 25ppm; COMPKEY: NO; COMPLOCKED: NO; DECOUPLER: NO; MEMORY: NO
RA29 = R_Dup2: PSpiceTemplate: R^@REFDES %1 %2 ?TOLERANCE|R^@REFDES| @VALUE  ?TOLERANCE|\n.model R^@REFDES RES R=1 DEV=@TOLERANCE%|; COMPGROUP: 1; COMPFIXED: NO; COMPHEIGHT: 0.000; COMPLOC: [3717.633,1936.433]; COMPROT: 90; COMPSIDE: TOP; Value: 49.9, 1%, 0603, 50ppm; COMPKEY: NO; COMPLOCKED: NO; DECOUPLER: NO; MEMORY: NO
RA30 = R_Dup2: PSpiceTemplate: R^@REFDES %1 %2 ?TOLERANCE|R^@REFDES| @VALUE  ?TOLERANCE|\n.model R^@REFDES RES R=1 DEV=@TOLERANCE%|; COMPGROUP: 1; COMPFIXED: NO; COMPHEIGHT: 0.000; COMPLOC: [3299.633,1880.000]; COMPROT: 180; COMPSIDE: TOP; Value: 10K, 0.5%, 25ppm, 0603; COMPKEY: NO; COMPLOCKED: NO; DECOUPLER: NO; MEMORY: NO
RA31 = R_Dup2: PSpiceTemplate: R^@REFDES %1 %2 ?TOLERANCE|R^@REFDES| @VALUE  ?TOLERANCE|\n.model R^@REFDES RES R=1 DEV=@TOLERANCE%|; COMPGROUP: 1; COMPFIXED: NO; COMPHEIGHT: 0.000; COMPLOC: [3344.633,1745.000]; COMPROT: 180; COMPSIDE: TOP; Value: 10K, 0.5%, 25ppm, 0603; COMPKEY: NO; COMPLOCKED: NO; DECOUPLER: NO; MEMORY: NO
RA32 = R_Dup2: PSpiceTemplate: R^@REFDES %1 %2 ?TOLERANCE|R^@REFDES| @VALUE  ?TOLERANCE|\n.model R^@REFDES RES R=1 DEV=@TOLERANCE%|; COMPGROUP: 1; COMPFIXED: NO; COMPHEIGHT: 0.000; COMPLOC: [3012.633,1536.433]; COMPROT: 90; COMPSIDE: TOP; Value: 10K, 0.5%, 25ppm, 0603; COMPKEY: NO; COMPLOCKED: NO; DECOUPLER: NO; MEMORY: NO
RA33 = R_Dup2: PSpiceTemplate: R^@REFDES %1 %2 ?TOLERANCE|R^@REFDES| @VALUE  ?TOLERANCE|\n.model R^@REFDES RES R=1 DEV=@TOLERANCE%|; COMPGROUP: 1; COMPFIXED: NO; COMPHEIGHT: 0.000; COMPLOC: [3012.633,1636.433]; COMPROT: 90; COMPSIDE: TOP; Value: 49.9, 1%, 0603, 50ppm; COMPKEY: NO; COMPLOCKED: NO; DECOUPLER: NO; MEMORY: NO
RA34 = R_Dup2: PSpiceTemplate: R^@REFDES %1 %2 ?TOLERANCE|R^@REFDES| @VALUE  ?TOLERANCE|\n.model R^@REFDES RES R=1 DEV=@TOLERANCE%|; COMPGROUP: 1; COMPFIXED: NO; COMPHEIGHT: 0.000; COMPLOC: [3402.633,1681.433]; COMPROT: 0; COMPSIDE: TOP; Value: 49.9, 1%, 0603, 50ppm; COMPKEY: NO; COMPLOCKED: NO; DECOUPLER: NO; MEMORY: NO
RA35 = R_Dup2: PSpiceTemplate: R^@REFDES %1 %2 ?TOLERANCE|R^@REFDES| @VALUE  ?TOLERANCE|\n.model R^@REFDES RES R=1 DEV=@TOLERANCE%|; COMPGROUP: 1; COMPFIXED: NO; COMPHEIGHT: 0.000; COMPLOC: [3457.633,1636.433]; COMPROT: 270; COMPSIDE: TOP; Value: 200, 1%, 0603, 25ppm; COMPKEY: NO; COMPLOCKED: NO; DECOUPLER: NO; MEMORY: NO
RA36 = R_Dup2: PSpiceTemplate: R^@REFDES %1 %2 ?TOLERANCE|R^@REFDES| @VALUE  ?TOLERANCE|\n.model R^@REFDES RES R=1 DEV=@TOLERANCE%|; COMPGROUP: 1; COMPFIXED: NO; COMPHEIGHT: 0.000; COMPLOC: [3719.633,1634.000]; COMPROT: 90; COMPSIDE: TOP; Value: 49.9, 1%, 0603, 50ppm; COMPKEY: NO; COMPLOCKED: NO; DECOUPLER: NO; MEMORY: NO
RA37 = R_Dup2: PSpiceTemplate: R^@REFDES %1 %2 ?TOLERANCE|R^@REFDES| @VALUE  ?TOLERANCE|\n.model R^@REFDES RES R=1 DEV=@TOLERANCE%|; COMPGROUP: 1; COMPFIXED: NO; COMPHEIGHT: 0.000; COMPLOC: [3112.633,1691.433]; COMPROT: 180; COMPSIDE: TOP; Value: 200, 1%, 0603, 25ppm; COMPKEY: NO; COMPLOCKED: NO; DECOUPLER: NO; MEMORY: NO
RA38 = R_Dup2: PSpiceTemplate: R^@REFDES %1 %2 ?TOLERANCE|R^@REFDES| @VALUE  ?TOLERANCE|\n.model R^@REFDES RES R=1 DEV=@TOLERANCE%|; COMPGROUP: 1; COMPFIXED: NO; COMPHEIGHT: 0.000; COMPLOC: [3112.633,1636.433]; COMPROT: 180; COMPSIDE: TOP; Value: 2K, 1%, 0603, 25ppm; COMPKEY: NO; COMPLOCKED: NO; DECOUPLER: NO; MEMORY: NO
RA39 = R_Dup2: PSpiceTemplate: R^@REFDES %1 %2 ?TOLERANCE|R^@REFDES| @VALUE  ?TOLERANCE|\n.model R^@REFDES RES R=1 DEV=@TOLERANCE%|; COMPGROUP: 1; COMPFIXED: NO; COMPHEIGHT: 0.000; COMPLOC: [3112.633,1581.433]; COMPROT: 180; COMPSIDE: TOP; Value: 10K, 0.5%, 25ppm, 0603; COMPKEY: NO; COMPLOCKED: NO; DECOUPLER: NO; MEMORY: NO
RA40 = R_Dup2: PSpiceTemplate: R^@REFDES %1 %2 ?TOLERANCE|R^@REFDES| @VALUE  ?TOLERANCE|\n.model R^@REFDES RES R=1 DEV=@TOLERANCE%|; COMPGROUP: 1; COMPFIXED: NO; COMPHEIGHT: 0.000; COMPLOC: [2737.633,1536.433]; COMPROT: 90; COMPSIDE: TOP; Value: 49.9, 1%, 0603, 50ppm; COMPKEY: NO; COMPLOCKED: NO; DECOUPLER: NO; MEMORY: NO
RA41 = R_Dup2: PSpiceTemplate: R^@REFDES %1 %2 ?TOLERANCE|R^@REFDES| @VALUE  ?TOLERANCE|\n.model R^@REFDES RES R=1 DEV=@TOLERANCE%|; COMPGROUP: 1; COMPFIXED: NO; COMPHEIGHT: 0.000; COMPLOC: [2537.633,1586.433]; COMPROT: 90; COMPSIDE: TOP; Value: 100, 1%, 0603, 25ppm; COMPKEY: NO; COMPLOCKED: NO; DECOUPLER: NO; MEMORY: NO
RA42 = R_Dup2: PSpiceTemplate: R^@REFDES %1 %2 ?TOLERANCE|R^@REFDES| @VALUE  ?TOLERANCE|\n.model R^@REFDES RES R=1 DEV=@TOLERANCE%|; COMPGROUP: 1; COMPFIXED: NO; COMPHEIGHT: 0.000; COMPLOC: [2787.633,1381.433]; COMPROT: 0; COMPSIDE: TOP; Value: 49.9, 1%, 0603, 50ppm; COMPKEY: NO; COMPLOCKED: NO; DECOUPLER: NO; MEMORY: NO
RA43 = R_Dup2: PSpiceTemplate: R^@REFDES %1 %2 ?TOLERANCE|R^@REFDES| @VALUE  ?TOLERANCE|\n.model R^@REFDES RES R=1 DEV=@TOLERANCE%|; COMPGROUP: 1; COMPFIXED: NO; COMPHEIGHT: 0.000; COMPLOC: [2232.633,1574.367]; COMPROT: 180; COMPSIDE: TOP; Value: DNL, 0603; COMPKEY: NO; COMPLOCKED: NO; DECOUPLER: NO; MEMORY: NO
RA44 = R_Dup2: PSpiceTemplate: R^@REFDES %1 %2 ?TOLERANCE|R^@REFDES| @VALUE  ?TOLERANCE|\n.model R^@REFDES RES R=1 DEV=@TOLERANCE%|; COMPGROUP: 1; COMPFIXED: NO; COMPHEIGHT: 0.000; COMPLOC: [2176.633,1629.367]; COMPROT: 180; COMPSIDE: TOP; Value: 0, 0603; COMPKEY: NO; COMPLOCKED: NO; DECOUPLER: NO; MEMORY: NO
RA45 = R_Dup2: PSpiceTemplate: R^@REFDES %1 %2 ?TOLERANCE|R^@REFDES| @VALUE  ?TOLERANCE|\n.model R^@REFDES RES R=1 DEV=@TOLERANCE%|; COMPGROUP: 1; COMPFIXED: NO; COMPHEIGHT: 0.000; COMPLOC: [3057.633,1471.433]; COMPROT: 0; COMPSIDE: TOP; Value: 2K, 1%, 0603, 25ppm; COMPKEY: NO; COMPLOCKED: NO; DECOUPLER: NO; MEMORY: NO
RA46 = R_Dup2: PSpiceTemplate: R^@REFDES %1 %2 ?TOLERANCE|R^@REFDES| @VALUE  ?TOLERANCE|\n.model R^@REFDES RES R=1 DEV=@TOLERANCE%|; COMPGROUP: 1; COMPFIXED: NO; COMPHEIGHT: 0.000; COMPLOC: [2887.633,1381.433]; COMPROT: 0; COMPSIDE: TOP; Value: 10K, 0.5%, 25ppm, 0603; COMPKEY: NO; COMPLOCKED: NO; DECOUPLER: NO; MEMORY: NO
RA47 = R_Dup2: PSpiceTemplate: R^@REFDES %1 %2 ?TOLERANCE|R^@REFDES| @VALUE  ?TOLERANCE|\n.model R^@REFDES RES R=1 DEV=@TOLERANCE%|; COMPGROUP: 1; COMPFIXED: NO; COMPHEIGHT: 0.000; COMPLOC: [3012.633,1471.433]; COMPROT: 270; COMPSIDE: TOP; Value: 49.9, 1%, 0603, 50ppm; COMPKEY: NO; COMPLOCKED: NO; DECOUPLER: NO; MEMORY: NO
RA48 = R_Dup2: PSpiceTemplate: R^@REFDES %1 %2 ?TOLERANCE|R^@REFDES| @VALUE  ?TOLERANCE|\n.model R^@REFDES RES R=1 DEV=@TOLERANCE%|; COMPGROUP: 1; COMPFIXED: NO; COMPHEIGHT: 0.000; COMPLOC: [3057.633,1526.433]; COMPROT: 0; COMPSIDE: TOP; Value: 10K, 0.5%, 25ppm, 0603; COMPKEY: NO; COMPLOCKED: NO; DECOUPLER: NO; MEMORY: NO
RA49 = R_Dup2: PSpiceTemplate: R^@REFDES %1 %2 ?TOLERANCE|R^@REFDES| @VALUE  ?TOLERANCE|\n.model R^@REFDES RES R=1 DEV=@TOLERANCE%|; COMPGROUP: 1; COMPFIXED: NO; COMPHEIGHT: 0.000; COMPLOC: [2276.633,1628.367]; COMPROT: 180; COMPSIDE: TOP; Value: DNL, 0603; COMPKEY: NO; COMPLOCKED: NO; DECOUPLER: NO; MEMORY: NO
RA50 = R_Dup2: PSpiceTemplate: R^@REFDES %1 %2 ?TOLERANCE|R^@REFDES| @VALUE  ?TOLERANCE|\n.model R^@REFDES RES R=1 DEV=@TOLERANCE%|; COMPGROUP: 1; COMPFIXED: NO; COMPHEIGHT: 0.000; COMPLOC: [3057.633,1416.433]; COMPROT: 0; COMPSIDE: TOP; Value: 200, 1%, 0603, 25ppm; COMPKEY: NO; COMPLOCKED: NO; DECOUPLER: NO; MEMORY: NO
RA51 = R_Dup2: PSpiceTemplate: R^@REFDES %1 %2 ?TOLERANCE|R^@REFDES| @VALUE  ?TOLERANCE|\n.model R^@REFDES RES R=1 DEV=@TOLERANCE%|; COMPGROUP: 1; COMPFIXED: NO; COMPHEIGHT: 0.000; COMPLOC: [3402.633,1426.433]; COMPROT: 0; COMPSIDE: TOP; Value: 49.9, 1%, 0603, 50ppm; COMPKEY: NO; COMPLOCKED: NO; DECOUPLER: NO; MEMORY: NO
RA52 = R_Dup2: PSpiceTemplate: R^@REFDES %1 %2 ?TOLERANCE|R^@REFDES| @VALUE  ?TOLERANCE|\n.model R^@REFDES RES R=1 DEV=@TOLERANCE%|; COMPGROUP: 1; COMPFIXED: NO; COMPHEIGHT: 0.000; COMPLOC: [3457.633,1471.433]; COMPROT: 90; COMPSIDE: TOP; Value: 200, 1%, 0603, 25ppm; COMPKEY: NO; COMPLOCKED: NO; DECOUPLER: NO; MEMORY: NO
RA53 = R_Dup2: PSpiceTemplate: R^@REFDES %1 %2 ?TOLERANCE|R^@REFDES| @VALUE  ?TOLERANCE|\n.model R^@REFDES RES R=1 DEV=@TOLERANCE%|; COMPGROUP: 1; COMPFIXED: NO; COMPHEIGHT: 0.000; COMPLOC: [3720.633,1433.433]; COMPROT: 90; COMPSIDE: TOP; Value: 49.9, 1%, 0603, 50ppm; COMPKEY: NO; COMPLOCKED: NO; DECOUPLER: NO; MEMORY: NO
RA54 = R_Dup2: PSpiceTemplate: R^@REFDES %1 %2 ?TOLERANCE|R^@REFDES| @VALUE  ?TOLERANCE|\n.model R^@REFDES RES R=1 DEV=@TOLERANCE%|; COMPGROUP: 1; COMPFIXED: NO; COMPHEIGHT: 0.000; COMPLOC: [1961.633,1632.367]; COMPROT: 270; COMPSIDE: TOP; Value: DNL, 0603; COMPKEY: NO; COMPLOCKED: NO; DECOUPLER: NO; MEMORY: NO
RA55 = R_Dup2: PSpiceTemplate: R^@REFDES %1 %2 ?TOLERANCE|R^@REFDES| @VALUE  ?TOLERANCE|\n.model R^@REFDES RES R=1 DEV=@TOLERANCE%|; COMPGROUP: 1; COMPFIXED: NO; COMPHEIGHT: 0.000; COMPLOC: [3304.633,1380.000]; COMPROT: 180; COMPSIDE: TOP; Value: 10K, 0.5%, 25ppm, 0603; COMPKEY: NO; COMPLOCKED: NO; DECOUPLER: NO; MEMORY: NO
RA56 = R_Dup2: PSpiceTemplate: R^@REFDES %1 %2 ?TOLERANCE|R^@REFDES| @VALUE  ?TOLERANCE|\n.model R^@REFDES RES R=1 DEV=@TOLERANCE%|; COMPGROUP: 1; COMPFIXED: NO; COMPHEIGHT: 0.000; COMPLOC: [2067.633,1624.367]; COMPROT: 90; COMPSIDE: TOP; Value: 0, 0603; COMPKEY: NO; COMPLOCKED: NO; DECOUPLER: NO; MEMORY: NO
UA1 = LTC2299 ADC x2_3: COMPGROUP: 1; COMPFIXED: NO; COMPHEIGHT: 0.000; COMPLOC: [2148.200,1762.000]; COMPROT: 90; COMPSIDE: TOP; COMPKEY: NO; COMPLOCKED: NO; DECOUPLER: NO; MEMORY: NO
UA2 = THS4131_DiffAmp_0: COMPGROUP: 1; COMPFIXED: NO; COMPHEIGHT: 0.000; COMPLOC: [2942.633,2146.433]; COMPROT: 180; COMPSIDE: TOP; COMPKEY: NO; COMPLOCKED: NO; DECOUPLER: NO; MEMORY: NO
UA3 = SN74CBT3253C 4MUX: COMPGROUP: 1; COMPFIXED: NO; COMPHEIGHT: 0.000; COMPLOC: [3182.633,1941.433]; COMPROT: 0; COMPSIDE: TOP; COMPKEY: NO; COMPLOCKED: NO; DECOUPLER: NO; MEMORY: NO
UA4 = THS4131_DiffAmp_0: COMPGROUP: 1; COMPFIXED: NO; COMPHEIGHT: 0.000; COMPLOC: [3667.633,2161.433]; COMPROT: 180; COMPSIDE: TOP; COMPKEY: NO; COMPLOCKED: NO; DECOUPLER: NO; MEMORY: NO
UA5 = THS4131_DiffAmp_0: COMPGROUP: 1; COMPFIXED: NO; COMPHEIGHT: 0.000; COMPLOC: [2942.633,1651.433]; COMPROT: 180; COMPSIDE: TOP; COMPKEY: NO; COMPLOCKED: NO; DECOUPLER: NO; MEMORY: NO
UA6 = SN74CBT3253C 4MUX: COMPGROUP: 1; COMPFIXED: NO; COMPHEIGHT: 0.000; COMPLOC: [3182.633,1441.433]; COMPROT: 0; COMPSIDE: TOP; COMPKEY: NO; COMPLOCKED: NO; DECOUPLER: NO; MEMORY: NO
UA7 = THS4131_DiffAmp_0: COMPGROUP: 1; COMPFIXED: NO; COMPHEIGHT: 0.000; COMPLOC: [3667.633,1661.433]; COMPROT: 180; COMPSIDE: TOP; COMPKEY: NO; COMPLOCKED: NO; DECOUPLER: NO; MEMORY: NO